# Altium schematic sheet Power supply.SchDoc: EOG_Monitor
size A4; Author: Nguyen Duy; DrawnBy: Nguyen Duy; Engineer: Nguyen Duy; SheetNumber: 2; SheetTotal: 4; Time: 14/02/2025
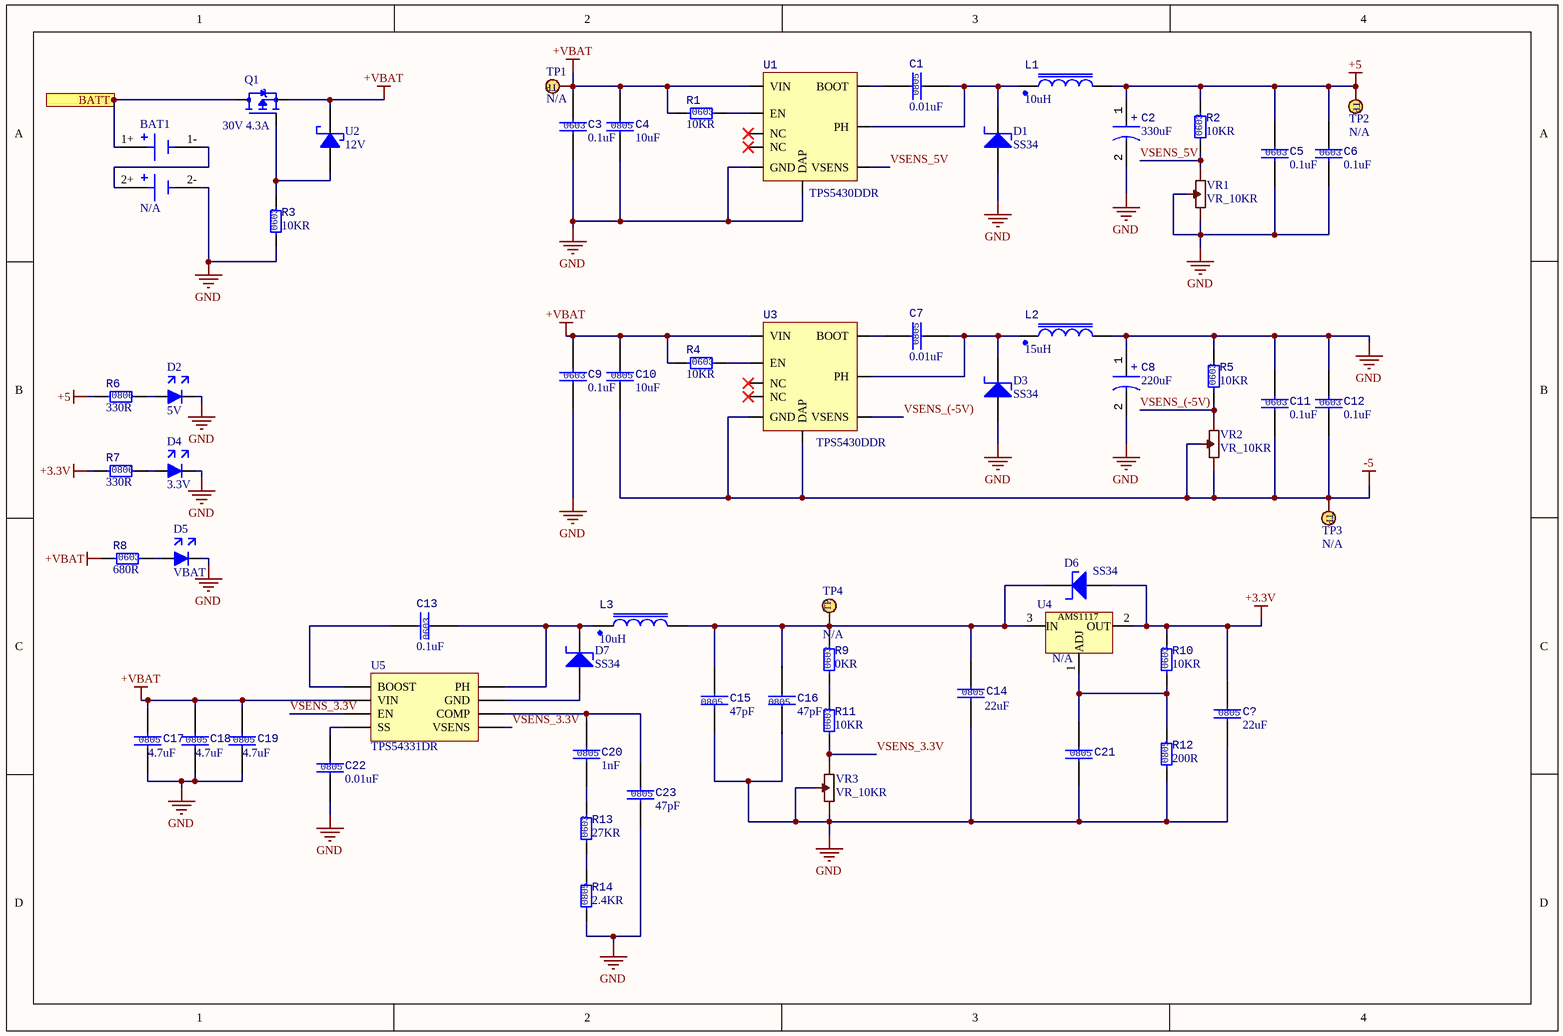
[diagram p0: Power supply.SchDoc]

## Parts
BAT1  Dual_Battery_Case  [Dual_BAT_PCB]  (value not drawn)
C1  Size: 0805  [CAPCER 0805 SMD]  (hidden comment: 0.01uF)
C2  330uF  [CAP ALU 6377]
C3  Size: 0603  [CAPCER 0805 SMD]  (hidden comment: 0.1uF)
C4  Size: 0805  [CAPCER 0603 SMD]  (hidden comment: 10uF)
C5  Size: 0603  [CAPCER 0805 SMD]  (hidden comment: 0.1uF)
C6  Size: 0603  [CAPCER 0805 SMD]  (hidden comment: 0.1uF)
C7  Size: 0805  [CAPCER 0805 SMD]  (hidden comment: 0.01uF)
C8  220uF  [CAP ALU 6377]
C9  Size: 0603  [CAPCER 0805 SMD]  (hidden comment: 0.1uF)
C10  Size: 0805  [CAPCER 0603 SMD]  (hidden comment: 10uF)
C11  Size: 0603  [CAPCER 0805 SMD]  (hidden comment: 0.1uF)
C12  Size: 0603  [CAPCER 0805 SMD]  (hidden comment: 0.1uF)
C13  Size: 0603  [CAPCER 0805 SMD]  (hidden comment: 0.1uF)
C14  Size: 0805  [CAPCER 0805 SMD]  (hidden comment: 22uF)
C15  Size: 0805  [CAPCER 0805 SMD]  (hidden comment: 47pF)
C16  Size: 0805  [CAPCER 0805 SMD]  (hidden comment: 47pF)
C17  Size: 0805  [CAPCER 0805 SMD]  (hidden comment: 4.7uF)
C18  Size: 0805  [CAPCER 0805 SMD]  (hidden comment: 4.7uF)
C19  Size: 0805  [CAPCER 0805 SMD]  (hidden comment: 4.7uF)
C20  Size: 0805  [CAPCER 0805 SMD]  (hidden comment: 1nF)
C21  Size: 0805  [CAPCER 0805 SMD]  (hidden comment: 10uF)
C22  Size: 0805  [CAPCER 0805 SMD]  (hidden comment: 0.01uF)
C23  Size: 0805  [CAPCER 0805 SMD]  (hidden comment: 47pF)
C?  Size: 0805  [CAPCER 0805 SMD]  (hidden comment: 22uF)
D1  SS34
D2  value 5V  [LED 0805 SMD]  (hidden comment: LED_RED)
D3  SS34
D4  value 3.3V  [LED 0805 SMD]  (hidden comment: LED_RED)
D5  value VBAT  [LED 0805 SMD]  (hidden comment: LED_RED)
D6  SS34  [DO-214AC]
D7  SS34  [DO-214AC]
L1  10uH  [INDUCTOR 1280 SMD]
L2  15uH  [INDUCTOR 1280 SMD]
L3  10uH  [INDUCTOR 1280 SMD]
Q1  value 30V 4.3A  [SOT23-3]  (hidden comment: AO3407A)
R1  Size: 0603  [RESC 0603(1608) SMD]  (hidden comment: 10KR)
R2  Size: 0603  [RESC 0603(1608) SMD]  (hidden comment: 10KR)
R3  Size: 0603  [RESC 0603(1608) SMD]  (hidden comment: 10KR)
R4  Size: 0603  [RESC 0603(1608) SMD]  (hidden comment: 10KR)
R5  Size: 0603  [RESC 0603(1608) SMD]  (hidden comment: 10KR)
R6  Size: 0806  [RESC 0805 SMD]  (hidden comment: 330R)
R7  Size: 0806  [RESC 0805 SMD]  (hidden comment: 330R)
R8  Size: 0603  [RESC 0603(1608) SMD]  (hidden comment: 680R)
R9  value 0KR  Size: 0603  [RESC 0603(1608) SMD]  (hidden comment: 0R)
R10  Size: 0603  [RESC 0603(1608) SMD]  (hidden comment: 10KR)
R11  Size: 0603  [RESC 0603(1608) SMD]  (hidden comment: 10KR)
R12  Size: 0805  [RESC 0805 SMD]  (hidden comment: 200R)
R13  Size: 0603  [RESC 0603(1608) SMD]  (hidden comment: 27KR)
R14  Size: 0805  [CAPCER 0805 SMD]  (hidden comment: 2.4KR)
TP1  TEST_POINT  [Test_point]  (value not drawn)
TP2  TEST_POINT  [Test_point]  (value not drawn)
TP3  TEST_POINT  [Test_point]  (value not drawn)
TP4  TEST_POINT  [Test_point]  (value not drawn)
U1  value TPS5430DDR  [8-SOIC]  (hidden comment: TPS5430DDAR)
U2  value 12V  [SOD-123F]  (hidden comment: BZT52H)
U3  value TPS5430DDR  [8-SOIC]  (hidden comment: TPS5430DDAR)
U4  AMS1117-ADJ  [SOT-223]  (value not drawn)
U5  TPS54331DR
VR1  VR_10KR  [EVM3E]
VR2  VR_10KR  [EVM3E]
VR3  VR_10KR  [EVM3E]

## Ports
BATT

## Nets
+3.3V: C?.1 D6.1(A) R7.1 R10.2 U4.2(OUT)
+5: C2.1 C5.1 C6.1 L1.2 R2.2 R6.1 TP2.1
+VBAT: C3.1 C4.1 C9.1 C10.1 C17.1 C18.1 C19.1 Q1.2(S) R1.1 R4.1 R8.1 TP1.1 U1.7(VIN) U2.2(K) U3.7(VIN) U5.2(VIN)
-5: C10.2 C11.2 C12.2 TP3.1 U3.6(GND) U3.9(DAP) VR2.1 VR2.2
GND: BAT1.2- C2.2 C3.2 C4.2 C5.2 C6.2 C8.1 C8.2 C9.2 C11.1 C12.1 C14.2 C15.1 C16.1 C17.2 C18.2 C19.2 C21.2 C22.2 C23.2 C?.2 D1.1(A) D2.C(K) D3.1(A) D4.C(K) D5.C(K) L2.2 R3.1 R5.2 R12.1 R14.1 U1.6(GND) U1.9(DAP) VR1.1 VR1.2 VR3.1 VR3.2
BATT: BAT1.1+ Q1.3(D) ; port BATT
VSENS_3.3V: R11.1 U5.3(EN) U5.5(VSENS) VR3.3
VSENS_5V: R2.1 U1.4(VSENS) VR1.3
VSENS_(-5V): R5.1 U3.4(VSENS) VR2.3
NetBAT1_1-: BAT1.1- BAT1.2+
NetC1_1: C1.1 U1.1(BOOT)
NetC1_2: C1.2 D1.2(K) L1.1 U1.8(PH)
NetC7_1: C7.1 U3.1(BOOT)
NetC7_2: C7.2 D3.2(K) L2.1 U3.8(PH)
NetC13_1: C13.1 D7.2(K) L3.1 U5.8(PH)
NetC13_2: C13.2 U5.1(BOOST)
NetC14_1: C14.1 C15.2 C16.2 D6.2(K) L3.2 R9.2 TP4.1 U4.3(IN)
NetC20_1: C20.1 C23.1 U5.6(COMP)
NetC20_2: C20.2 R13.2
NetC21_1: C21.1 R10.1 R12.2 U4.1(ADJ)
NetC22_1: C22.1 U5.4(SS)
NetD2_A: D2.A R6.2
NetD4_A: D4.A R7.2
NetD5_A: D5.A R8.2
NetD7_1: D7.1(A) U5.7(GND)
NetQ1_1: Q1.1(G) R3.2 U2.1(A)
NetR1_2: R1.2 U1.5(EN)
NetR4_2: R4.2 U3.5(EN)
NetR9_1: R9.1 R11.2
NetR13_1: R13.1 R14.2

Not connected (* = marked no-connect by the designer): U1 2(NC) 3(NC); U3 2(NC) 3(NC)

## Notes on the sheet
- (in symbol DB-0013) +
- (in symbol DB-0034) TP
- (in symbol DB-0044) +

## Library data of the parts
BAT1 = DB-0031: Dual_Battery_Case_18650; Value: N/A; Footprint Path: .\Database_Library\Library.PcbLib; Design Item ID: DB-0031; Type: Case; Power Rate: N/A; Tolerance: N/A; Footprint Type: TFT; Supplier Link: https://www.thegioiic.com/de-pin-2x18650-han-pcb
C1 C7 C22 = DB-0010: CAPACITOR SMD 0.01uF 50V 10% 0805; Value: 0.01uF; Design Item ID: DB-0010; Type: CAPACITOR; Power Rate: N/A; Tolerance: 10%; Footprint Type: SMD; Supplier: THEGIOIIC; Supplier Part Number: Tụ Gốm 0805 410nF 50V; Supplier Link: https://www.thegioiic.com/tu-gom-0805-10nf-50v
  C1 C7: Footprint Path: .\Database_Library\Library.PcbLib
C2 = DB-0044: CAPACITOR ALU SMD 220uF 6.3V 20% 6377; Value: 330uF; Design Item ID: DB-0044; Type: CAPACITOR ALU; Power Rate: N/A; Tolerance: 20%; Footprint Type: SMD; Size: 6377; Supplier: THEGIOIIC; Supplier Part Number: Tụ Nhôm SMD 330uF 6.3V 6.3x7.7mm; Supplier Link: https://www.thegioiic.com/tu-nhom-smd-330uf-6-3v-6-3x7-7mm
C3 C5 C6 C9 C11-C13 = DB-0017: CAPACITOR SMD 0.1uF 50V 10% 0603; Value: 0.1uF; Design Item ID: DB-0017; Type: CAPACITOR; Power Rate: N/A; Tolerance: 10%; Footprint Type: SMD; Supplier: THEGIOIIC; Supplier Part Number: Tụ Gốm 0603 100nF (0.1uF) 25V; Supplier Link: https://www.thegioiic.com/tu-gom-0603-100nf-0-1uf-25v
  C3 C5 C6 C9 C11 C12: Footprint Path: .\Database_Library\Library.PcbLib
C4 C10 = DB-0018: CAPACITOR SMD 10uF 25V 10% 0805; Value: 10uF; Footprint Path: .\Database_Library\Library.PcbLib; Design Item ID: DB-0018; Type: CAPACITOR; Power Rate: N/A; Tolerance: 10%; Footprint Type: SMD; Supplier: THEGIOIIC; Supplier Part Number: Tụ Gốm 0805 10uF 25V; Supplier Link: https://www.thegioiic.com/tu-gom-0805-10uf-25v
C8 = DB-0013: CAPACITOR ALU SMD 220uF 16V 10% 6377; Value: 220uF; Footprint Path: .\Database_Library\Library.PcbLib; Design Item ID: DB-0013; Type: CAPACITOR ALU; Power Rate: N/A; Tolerance: N/A; Footprint Type: SMD; Size: 6377; Supplier: THEGIOIIC; Supplier Part Number: Tụ Nhôm SMD 220uF 16V 6.3x7.7mm; Supplier Link: https://www.thegioiic.com/tu-nhom-smd-220uf-16v-6-3x7-7mm
C14 C? = DB-0056: CAPACITOR SMD 22uF 50V 10% 0805; Value: 22uF; Design Item ID: DB-0056; Type: CAPACITOR; Power Rate: N/A; Tolerance: 10%; Footprint Type: SMD; Supplier: THEGIOIIC; Supplier Part Number: Tụ Gốm 0805 22uF 6.3V; Supplier Link: https://www.thegioiic.com/tu-gom-0805-22uf-6-3v
C15 C16 C23 = DB-0036: CAPACITOR SMD 47pF 50V 10% 0805; Value: 47pF; Design Item ID: DB-0036; Type: CAPACITOR; Power Rate: N/A; Tolerance: 10%; Footprint Type: SMD; Supplier: THEGIOIIC; Supplier Part Number: Tụ Gốm 0805 47pF 50V; Supplier Link: https://www.thegioiic.com/tu-gom-0805-47pf-50v
C17-C19 = DB-0007: CAPACITOR SMD 4.7uF 50V 10% 0805; Value: 4.7uF; Design Item ID: DB-0007; Type: CAPACITOR; Power Rate: N/A; Tolerance: 10%; Footprint Type: SMD; Supplier: THEGIOIIC; Supplier Part Number: Tụ Gốm 0805 4.7uF 50V; Supplier Link: https://www.thegioiic.com/tu-gom-0805-4-7uf-50v
C20 = DB-0037: CAPACITOR SMD 1nF 50V 10% 0805; Value: 1nF; Design Item ID: DB-0037; Type: CAPACITOR; Power Rate: N/A; Tolerance: 10%; Footprint Type: SMD; Supplier: THEGIOIIC; Supplier Part Number: Tụ Gốm 0805 1nF 50V; Supplier Link: https://www.thegioiic.com/tu-gom-0805-1nf-50v
C21 = DB-0058: CAPACITOR SMD 10uF 25V 10% 0805; Design Item ID: DB-0058; Type: CAPACITOR; Power Rate: N/A; Tolerance: 10%; Footprint Type: SMD; Supplier: THEGIOIIC; Supplier Part Number: Tụ Gốm 0805 10uF 25V; Supplier Link: https://www.thegioiic.com/tu-gom-0805-10uf-25v
D1 D3 = DB-0032: Design Item ID: DB-0032
D2 D4 D5 = DB-0020: Size 2x1.2mm, điện áp 1.8-2.6VDC; Type: LED; Design Item ID: DB-0020; Power Rate: N/A; Tolerance: N/A; Footprint Type: SMD; Size: 0806; Supplier: THEGIOIIC; Supplier Part Number: LED Đỏ 0805 Dán SMD Trong Suốt Harvatek; Supplier Link: https://www.thegioiic.com/led-do-0805-dan-smd-trong-suot-harvatek
D6 D7 = DB-0032: SS34 SMC Diode Schottky 3A; Value: SS34; Design Item ID: DB-0032; Type: DIODE; Power Rate: N/A; Tolerance: N/A; Footprint Type: SMD; Size: SMA; Supplier: THEGIOIIC; Supplier Part Number: TWGMC SS34 SMA Diode Schottky 3A; Supplier Link: https://www.thegioiic.com/twgmc-ss34-sma-diode-schottky-3a
L1 L3 = DB-0043: INDUCTOR SMD 10uH 1280-100 7.1A; Tolerance: 20%; Value: 10uH; Design Item ID: DB-0043; Type: INDUCTOR; Power Rate: N/A; Footprint Type: SMD; Size: 1280; Supplier: THEGIOIIC; Supplier Part Number: Cuộn Cảm Dán SMD CDRH127 1280-100 10uH 7.8A; Supplier Link: https://www.thegioiic.com/cuon-cam-dan-smd-cdrh127-1280-100-10uh-7-8a
L2 = DB-0033: INDUCTOR SMD 15uH 1280-150 7.1A; Tolerance: 20%; Value: 15uH; Design Item ID: DB-0033; Type: INDUCTOR; Power Rate: N/A; Footprint Type: SMD; Size: 1280; Supplier: THEGIOIIC; Supplier Part Number: Cuộn Cảm Dán SMD CDRH127 1280-150 15uH 7.1A; Supplier Link: https://www.thegioiic.com/cuon-cam-dan-smd-cdrh127-1280-150-15uh-7-1a
Q1 = DB-0041: AO3407A MOSFET Kênh P 30V 4.3A SOT-23-3; Type: P_MOSFET; Design Item ID: DB-0041; Power Rate: N/A; Tolerance: N/A; Footprint Type: SMD; Size: SOT23-3; Supplier: THEGIOIIC; Supplier Part Number: AO3407A MOSFET Kênh P 30V 4.3A SOT-23-3; Supplier Link: https://www.thegioiic.com/ao3407a-mosfet-kenh-p-30v-4-3a-sot-23-3
R1-R5 R10 R11 = DB-0003: RESISTOR SMD 10KR OHM 1% 100mW 0603; Power Rate: 100mW; Value: 10KR; Design Item ID: DB-0003; Type: RESISTOR; Tolerance: 1%; Footprint Type: SMD; Supplier: THEGIOIIC; Supplier Part Number: Điện Trở 10 KOhm 0603 1%; Supplier Link: https://www.thegioiic.com/dien-tro-10-kohm-0603-1-
  R1 R2 R4 R5: Footprint Path: .\Database_Library\Library.PcbLib
R6 R7 = DB-0048: RESISTOR SMD 330R OHM 1% 125mW 0805; Power Rate: 125mW; Value: 330R; Design Item ID: DB-0048; Type: RESISTOR; Tolerance: 1%; Footprint Type: SMD; Supplier: THEGIOIIC; Supplier Part Number: Điện Trở 330 Ohm 0805 1%; Supplier Link: https://www.thegioiic.com/dien-tro-330-ohm-0805-1-
R8 = DB-0001: RESISTOR SMD 680R OHM 5% 100mW 0603; Power Rate: 100mW; Value: 680R; Design Item ID: DB-0001; Type: RESISTOR; Tolerance: 5%; Footprint Type: SMD; Supplier: THEGIOIIC; Supplier Part Number: Điện Trở 680 Ohm 0603 5%; Supplier Link: https://www.thegioiic.com/dien-tro-680-ohm-0603-5-
R9 = DB-0040: RESISTOR SMD 0KR OHM 1% 100mW 0603; Power Rate: 100MmW; Design Item ID: DB-0040; Type: RESISTOR; Tolerance: 1%; Footprint Type: SMD; Supplier: THEGIOIIC; Supplier Part Number: Điện Trở 0 Ohm 0603 1%; Supplier Link: https://www.thegioiic.com/dien-tro-0-ohm-0603-1-
R12 = DB-0057: RESISTOR SMD 200R OHM 5% 125mW 0805; Power Rate: 125mW; Value: 200R; Design Item ID: DB-0057; Type: RESISTOR; Tolerance: 5%; Footprint Type: SMD; Supplier: THEGIOIIC; Supplier Part Number: Điện Trở 200 Ohm 0805 5%; Supplier Link: https://www.thegioiic.com/dien-tro-200-ohm-0805-5-
R13 = DB-0038: RESISTOR SMD 27KR OHM 1% 100mW 0603; Power Rate: 100MmW; Value: 27KR; Design Item ID: DB-0038; Type: RESISTOR; Tolerance: 1%; Footprint Type: SMD; Supplier: THEGIOIIC; Supplier Part Number: Điện Trở 27 KOhm 0603 1%
R14 = DB-0039: RESISTOR SMD 2.4KR OHM 5% 100mW 0805; Power Rate: 100MmW; Value: 2.4KR; Design Item ID: DB-0039; Type: RESISTOR; Tolerance: 5%; Footprint Type: SMD; Supplier: THEGIOIIC; Supplier Part Number: Điện Trở 2.4 KOhm 0805 5%; Supplier Link: https://www.thegioiic.com/dien-tro-2-4-kohm-0805-5-
TP1-TP4 = DB-0034: Value: N/A; Design Item ID: DB-0034; Power Rate: N/A; Tolerance: N/A; Footprint Type: PAD; Size: PAD
U1 U3 = DB-0002: TPS543x 3A, Wide Input Range, Step-Down Converter; Footprint Path: .\Database_Library\Library.PcbLib; Design Item ID: DB-0002; Type: IC; Power Rate: N/A; Tolerance: N/A; Footprint Type: SMD; Size: 8-SOIC; Supplier: THEGIOIIC; Supplier Part Number: TPS5430DDAR IC Điều Chỉnh Giảm Áp 3A 8-SOIC; Supplier Link: https://www.thegioiic.com/tps5430ddar-ic-dieu-chinh-giam-ap-3a-8-soic
U2 = DB-0042: BZT52H-C12 Diode Zener 12V 375mW SOD-123F; Tolerance: 5%; Design Item ID: DB-0042; Type: DIODE_ZE; Power Rate: 375mW; Footprint Type: SMD; Size: SOD-123F; Supplier: THEGIOIIC; Supplier Part Number: BZT52H-C12 Diode Zener 12V 375mW SOD-123F; Supplier Link: https://www.thegioiic.com/bzt52c5v1-diode-zener-5-1v-500mw
U4 = DB-0030: AMS1117-3.3V IC Ổn Áp 3.3V 1A SOT-223; Value: N/A; Design Item ID: DB-0030; Type: IC; Power Rate: N/A; Tolerance: N/A; Footprint Type: SMD; Size: SOT-223; Supplier: THEGIOIIC; Supplier Part Number: AMS1117-3.3V IC Ổn Áp 3.3V 1A SOT-223; Supplier Link: https://www.thegioiic.com/ams1117-3-3v-ic-on-ap-3-3v-1a-sot-223
VR1-VR3 = DB-0026: EVM3E-103 Biến Trở 10 KOhm Nút Áo SMD 0.15W; Tolerance: 20%; Value: VR_10KR; Design Item ID: DB-0026; Type: VRES; Power Rate: 0.15W; Footprint Type: SMD; Size: EVM3E; Supplier: THEGIOIIC; Supplier Part Number: EVM3E-103 Biến Trở 10 KOhm Nút Áo SMD 0.15W; Supplier Link: https://www.thegioiic.com/evm3e-103-bien-tro-10-kohm-nut-ao-smd-0-15w